# EasyEDA schematic SCH_Design.json
TITLE: Sheet_1; REV: 1.0; Date: 2024-03-21; Sheet: 1/1; Drawn By: josh_vinod; Company: Your Company
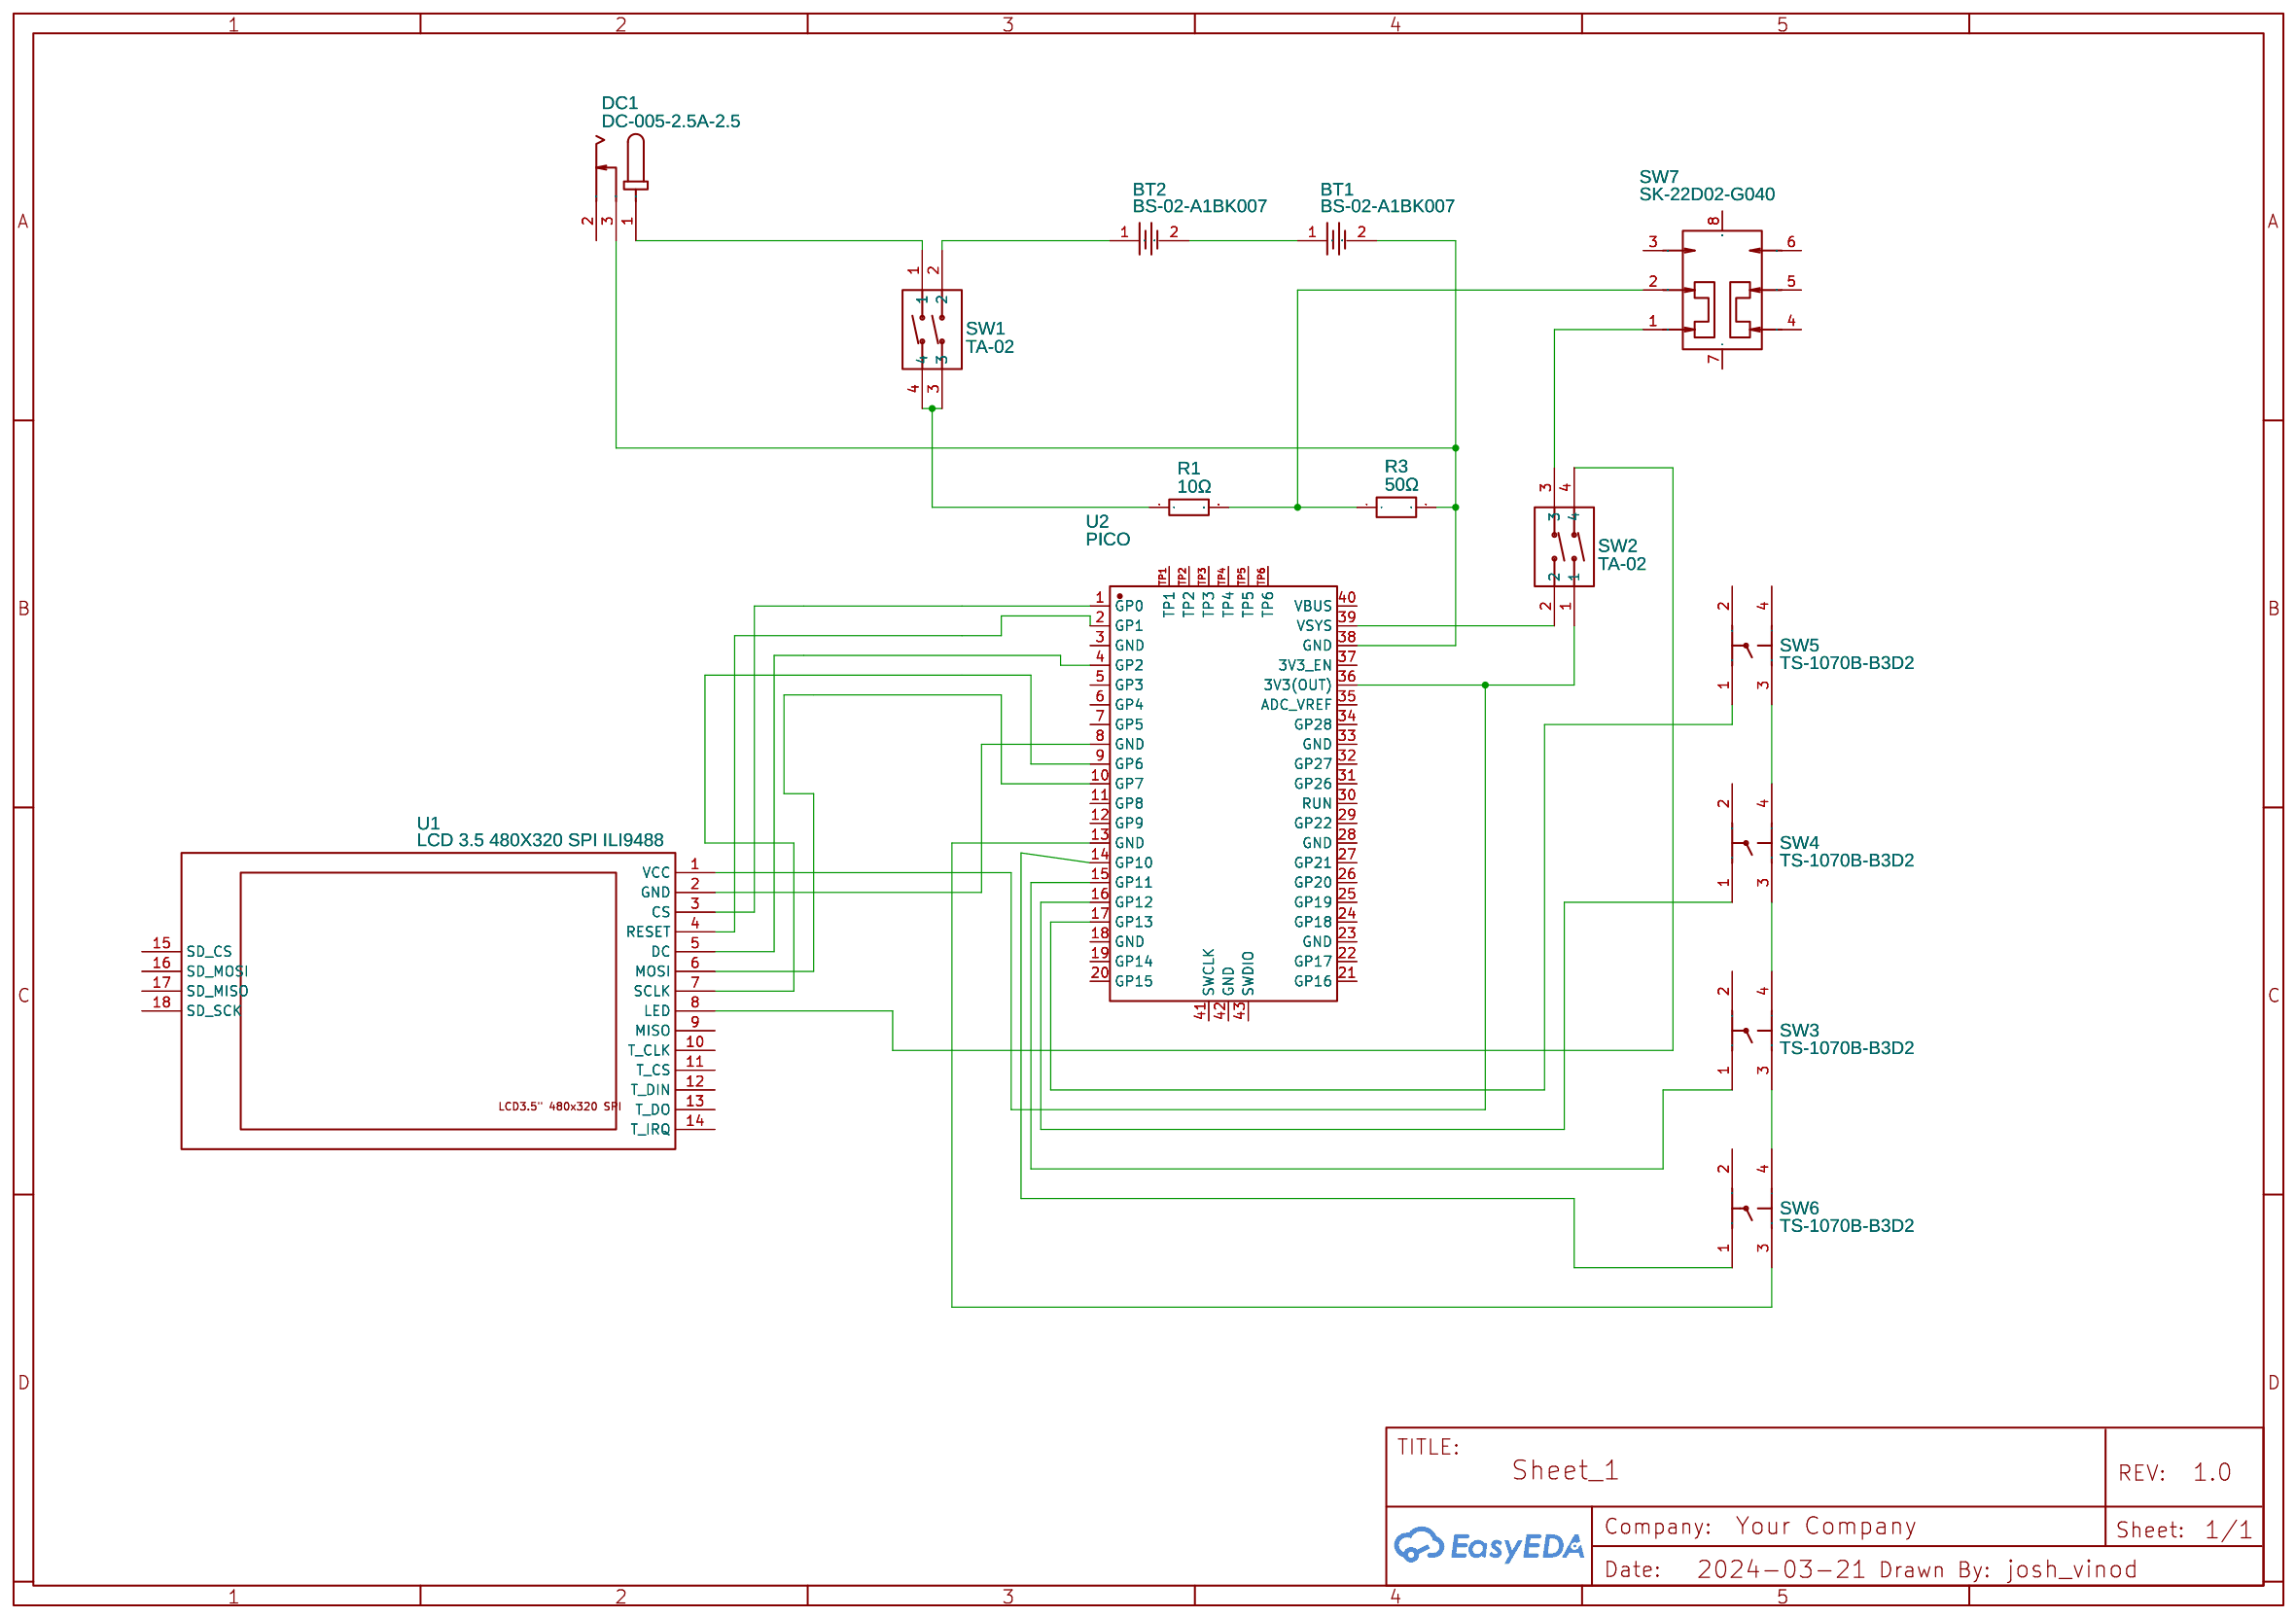
[diagram p0: schematic sheet]

## Parts
BT1  BS-02-A1BK007  [BAT-TH_BS-02-A1BK007]
BT2  BS-02-A1BK007  [BAT-TH_BS-02-A1BK007]
DC1  DC-005-2.5A-2.5  [CONN-TH_DC-005-2.5A-2.0]
R1  10Ω  [R0603]
R3  50Ω  [R0805]
SW1  TA-02  [SW-TH_4P-L6.6-W9.6-P2.54-LS7.62]
SW2  TA-02  [SW-TH_4P-L6.6-W9.6-P2.54-LS7.62]
SW3  TS-1070B-B3D2  [SW-SMD_4P-L4.2-W3.3-P2.15-LS5.1]
SW4  TS-1070B-B3D2  [SW-SMD_4P-L4.2-W3.3-P2.15-LS5.1]
SW5  TS-1070B-B3D2  [SW-SMD_4P-L4.2-W3.3-P2.15-LS5.1]
SW6  TS-1070B-B3D2  [SW-SMD_4P-L4.2-W3.3-P2.15-LS5.1]
SW7  SK-22D02-G040  [SW-TH_SK-22D02-G040]
U1  LCD 3.5 480X320 SPI ILI9488  [LCD 3.5 480X320 ILI9488 SPI]
U2  PICO  [COMM-SMD_L51.0-W21.0-P2.54_SC0916]

## Library data of the parts
BT1 BT2 = BS-02-A1BK007: Contributor: LCSC; Supplier: LCSC; Supplier Part: C964744; Manufacturer: MYOUNG(美阳); JLCPCB Part Class: Extended Part
DC1 = DC-005-2.5A-2.5: Contributor: LCSC; Supplier: LCSC; Supplier Part: C319098; Manufacturer: XKB Enterprise; JLCPCB Part Class: Extended Part; link: https://lcsc.com/eda_search?q=C319098&%26type=1&ref=editor
R1 = 0603WAF100JT5E: Supplier: LCSC; Manufacturer: UNI-ROYAL(厚声); Supplier Part: C22859; JLCPCB Part Class: Basic Part
R3 = ARG05FTC0500: Contributor: LCSC; Supplier: LCSC; Supplier Part: C2828866; Manufacturer: Viking(光颉); JLCPCB Part Class: Extended Part
SW1 SW2 = TA-02: Contributor: LCSC; Supplier: LCSC; Supplier Part: C559137; Manufacturer: Yuandi(元迪); JLCPCB Part Class: Extended Part
SW3-SW6 = TS-1070B-B3D2: Contributor: LCSC; Supplier: LCSC; Supplier Part: C492880; Manufacturer: Yuandi(元迪); JLCPCB Part Class: Extended Part
SW7 = SK-22D02-G040: Contributor: LCSC; Supplier: LCSC; Supplier Part: C2848889; Manufacturer: G-Switch(品赞); JLCPCB Part Class: Extended Part
U1 = LCD 3.5 480X320 SPI ILI9488: Contributor: dzingoni
U2 = PICO: Supplier: LCSC; Supplier Part: C7203002; Manufacturer: Raspberry Pi(树莓派); JLCPCB Part Class: Extended Part; Contributor: lcsc

## Nets
Net-(BT1-1): BT1.1 BT2.2
Net-(BT1-2): BT1.2 DC1.3 R3.2 U2.38(GND)
Net-(BT2-1): BT2.1 SW1.2
Net-(DC1-1): DC1.1 SW1.1
Net-(R1-1): R1.1 SW1.3 SW1.4
Net-(R1-2): R1.2 R3.1 SW7.2
Net-(SW2-1): SW2.1 U1.1(VCC) U2.36(3V3(OUT))
Net-(SW2-2): SW2.2 U2.39(VSYS)
Net-(SW2-3): SW2.3 SW7.1
Net-(SW2-4): SW2.4 U1.8(LED)
Net-(SW3-1): SW3.1 U2.15(GP11)
Net-(SW3-3): SW3.3 SW6.4
Net-(SW3-4): SW3.4 SW4.3
Net-(SW4-1): SW4.1 U2.16(GP12)
Net-(SW4-4): SW4.4 SW5.3
Net-(SW5-1): SW5.1 U2.17(GP13)
Net-(SW6-1): SW6.1 U2.14(GP10)
Net-(SW6-3): SW6.3 U2.13(GND)
Net-(U1-2): U1.2(GND) U2.8(GND)
Net-(U1-3): U1.3(CS) U2.1(GP0)
Net-(U1-4): U1.4(RESET) U2.2(GP1)
Net-(U1-5): U1.5(DC) U2.4(GP2)
Net-(U1-6): U1.6(MOSI) U2.10(GP7)
Net-(U1-7): U1.7(SCLK) U2.9(GP6)

Not connected (* = marked no-connect by the designer): DC1 2; SW3 2; SW4 2; SW5 2 4; SW6 2; SW7 3 4 5 6 7 8; U1 9(MISO) 10(T_CLK) 11(T_CS) 12(T_DIN) 13(T_DO) 14(T_IRQ) 15(SD_CS) 16(SD_MOSI) 17(SD_MISO) 18(SD_SCK); U2 3(GND) 5(GP3) 6(GP4) 7(GP5) 11(GP8) 12(GP9) 18(GND) 19(GP14) 20(GP15) 21(GP16) 22(GP17) 23(GND) 24(GP18) 25(GP19) 26(GP20) 27(GP21) 28(GND) 29(GP22) 30(RUN) 31(GP26) 32(GP27) 33(GND) 34(GP28) 35(ADC_VREF) 37(3V3_EN) 40(VBUS) 41(SWCLK) 42(GND) 43(SWDIO) TP1 TP2 TP3 TP4 TP5 TP6
